# Altium schematic sheet POWER.SchDoc
size A4
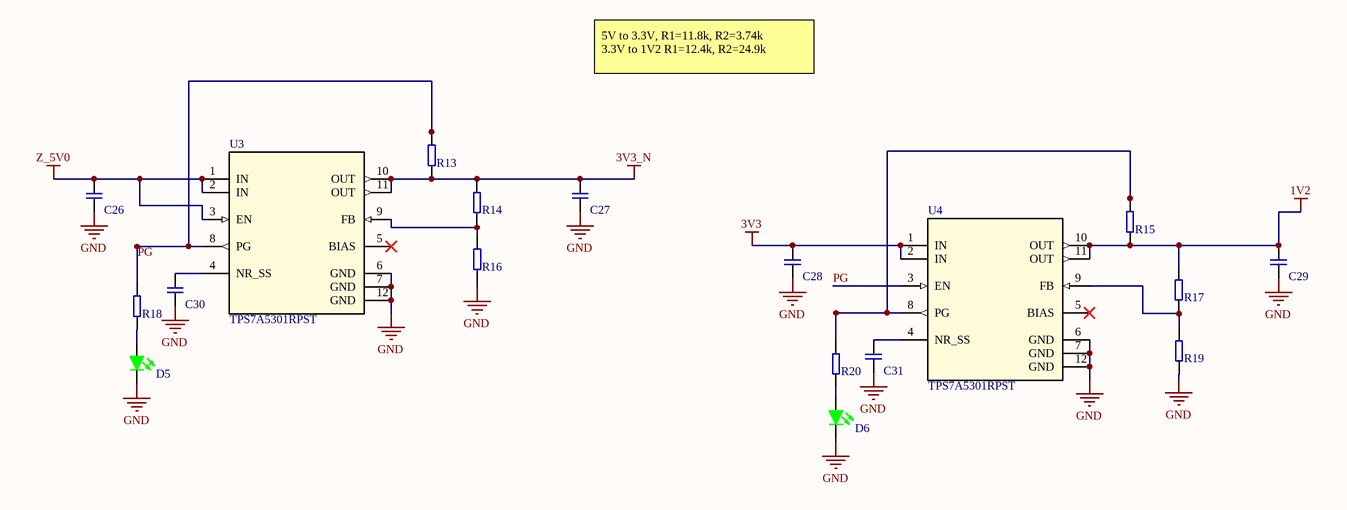
[diagram p0: POWER.SchDoc]

## Parts
C26  47uF  [C1210]  (value not drawn)
C27  47uF  [C0805]  (value not drawn)
C28  47uF  [C1210]  (value not drawn)
C29  47uF  [C0805]  (value not drawn)
C30  100nF  [C0402]  (value not drawn)
C31  100nF  [C0402]  (value not drawn)
D5  SML-LX0603GW-TR  [L0603]  (value not drawn)
D6  SML-LX0603GW-TR  [L0603]  (value not drawn)
R13  1K  [R0402]  (value not drawn)
R14  11.8K  [R0603]  (value not drawn)
R15  1K  [R0402]  (value not drawn)
R16  3.74K  [R0603]  (value not drawn)
R17  12.4K  [R0402]  (value not drawn)
R18  1K  [R0402]  (value not drawn)
R19  24.9K  [R0402]  (value not drawn)
R20  1K  [R0402]  (value not drawn)
U3  TPS7A5301RPST  [RPS0012A-MFG]
U4  TPS7A5301RPST  [RPS0012A-MFG]

## Nets
1V2: C29.2 R15.1 R17.2 U4.10(OUT) U4.11(OUT)
3V3: C28.2 U4.1(IN) U4.2(IN)
3V3_N: C27.2 R13.1 R14.2 U3.10(OUT) U3.11(OUT)
GND: C26.1 C27.1 C28.1 C29.1 C30.1 C31.1 D5.C D6.C R16.1 R19.1 U3.6(GND) U3.7(GND) U3.12(GND) U4.6(GND) U4.7(GND) U4.12(GND)
Z_5V0: C26.2 U3.1(IN) U3.2(IN) U3.3(EN)
PG: R13.2 R18.2 U3.8(PG) U4.3(EN)
NetC30_2: C30.2 U3.4(NR_SS)
NetC31_2: C31.2 U4.4(NR_SS)
NetD5_A: D5.A R18.1
NetD6_A: D6.A R20.1
NetR14_1: R14.1 R16.2 U3.9(FB)
NetR15_2: R15.2 R20.2 U4.8(PG)
NetR17_1: R17.1 R19.2 U4.9(FB)

Not connected (* = marked no-connect by the designer): U3 5(BIAS)*; U4 5(BIAS)*

## Notes on the sheet
- 5V to 3.3V, R1=11.8k, R2=3.74k             3.3V to 1V2 R1=12.4k, R2=24.9k

## Library data of the parts
C26 C28 = CL32A476KOJNNNE: MLCC (3225) 1210 47uF 16VDC ±10% X5R; Que: 141; Part Number: CL32A476KOJNNNE
C27 C29 = C2012X5R1A476M125AC: MLCC (2012) 0805 47uF 10VDC ±20% X5R; Que: 136; Part Number: C2012X5R1A476M125AC
C30 C31 = CL05B104KB5NNNC: 402; Que: 129; Part Number: CL05B104KB5NNNC
D5 D6 = SML-LX0603GW-TR: LED GREEN DIFFUSED SMD; Manufacturer: Lumex Opto/Components Inc.; Que: 001; Forward Voltage: 2.2V; Current: 20mA; Name: Recep Aydin; Part Number: SML-LX0603GW-TR; LensTransparency: Diffused; Color: Green; Package: 0603(1608 Metric); Datasheet: https://www.lumex.com/datasheet/SML-LX0603GW-TR; Manufacturer Part Number: SML-LX0603GW-TR
R13 R15 R18 R20 = RT0402BRE071KL: RES SMD 1K OHM 0.1% 1/16W 0402; Manufacturer: Yageo; Que: 015; Name: Recep Aydin; Part Number: RT0402BRE071KL; Tolerance: 0.1%; Resistor Type: Thick Film; Package: 0402; Datasheet: https://www.yageo.com/upload/media/product/productsearch/datasheet/rchip/PYu-RT_1-to-0.01_RoHS_L_12.pdf; Manufacturer Part Number: RT0402BRE071KL
R14 = RMCF0603FT11K8: RES 11.8K OHM 1% 1/10W 0603; Manufacturer: Stackpole Electronics Inc; Que: 036; Tolerance: 0.1%; Name: Recep Aydin; Part Number: RMCF0603FT11K8; Resistor Type: Thick Film; Package: 0603; Datasheet: https://www.seielect.com/catalog/sei-rmcf_rmcp.pdf; Manufacturer Part Number: RMCF0603FT11K8
R16 = RC0603FR-073K74L: RES 3.74K OHM 1% 1/10W 0603; Manufacturer: YAGEO; Que: 075; Name: Recep Aydin; Part Number: RC0603FR-073K74L; Tolerance: 1%; Resistor Type: Thick Film; Package: 0603; Datasheet: https://www.yageo.com/upload/media/product/productsearch/datasheet/rchip/PYu-RC_Group_51_RoHS_L_11.pdf; Manufacturer Part Number: RC0603FR-073K74L
R17 = RC0402FR-0712K4L: RES 12.4K OHM 1% 1/16W 0402; Que: 178; Part Number: RC0402FR-0712K4L
R19 = RC0402FR-0724K9L: RES 24.9K OHM 1% 1/16W 0402; Que: 179; Part Number: RC0402FR-0724K9L
U3 U4 = TPS7A5301RPST: Mfr_Name: Texas Instruments; Que: 047; Type: DEV; RefDes: RefDes; Copyright: Copyright (C) 2024 Ultra Librarian. All rights reserved.; Manufacturer_Part_Number: TPS7A5301RPST; Part Number: TPS7A5301RPST